# Altium schematic sheet Overview and Power.SchDoc
size A; SheetNumber: 1; SheetTotal: 9
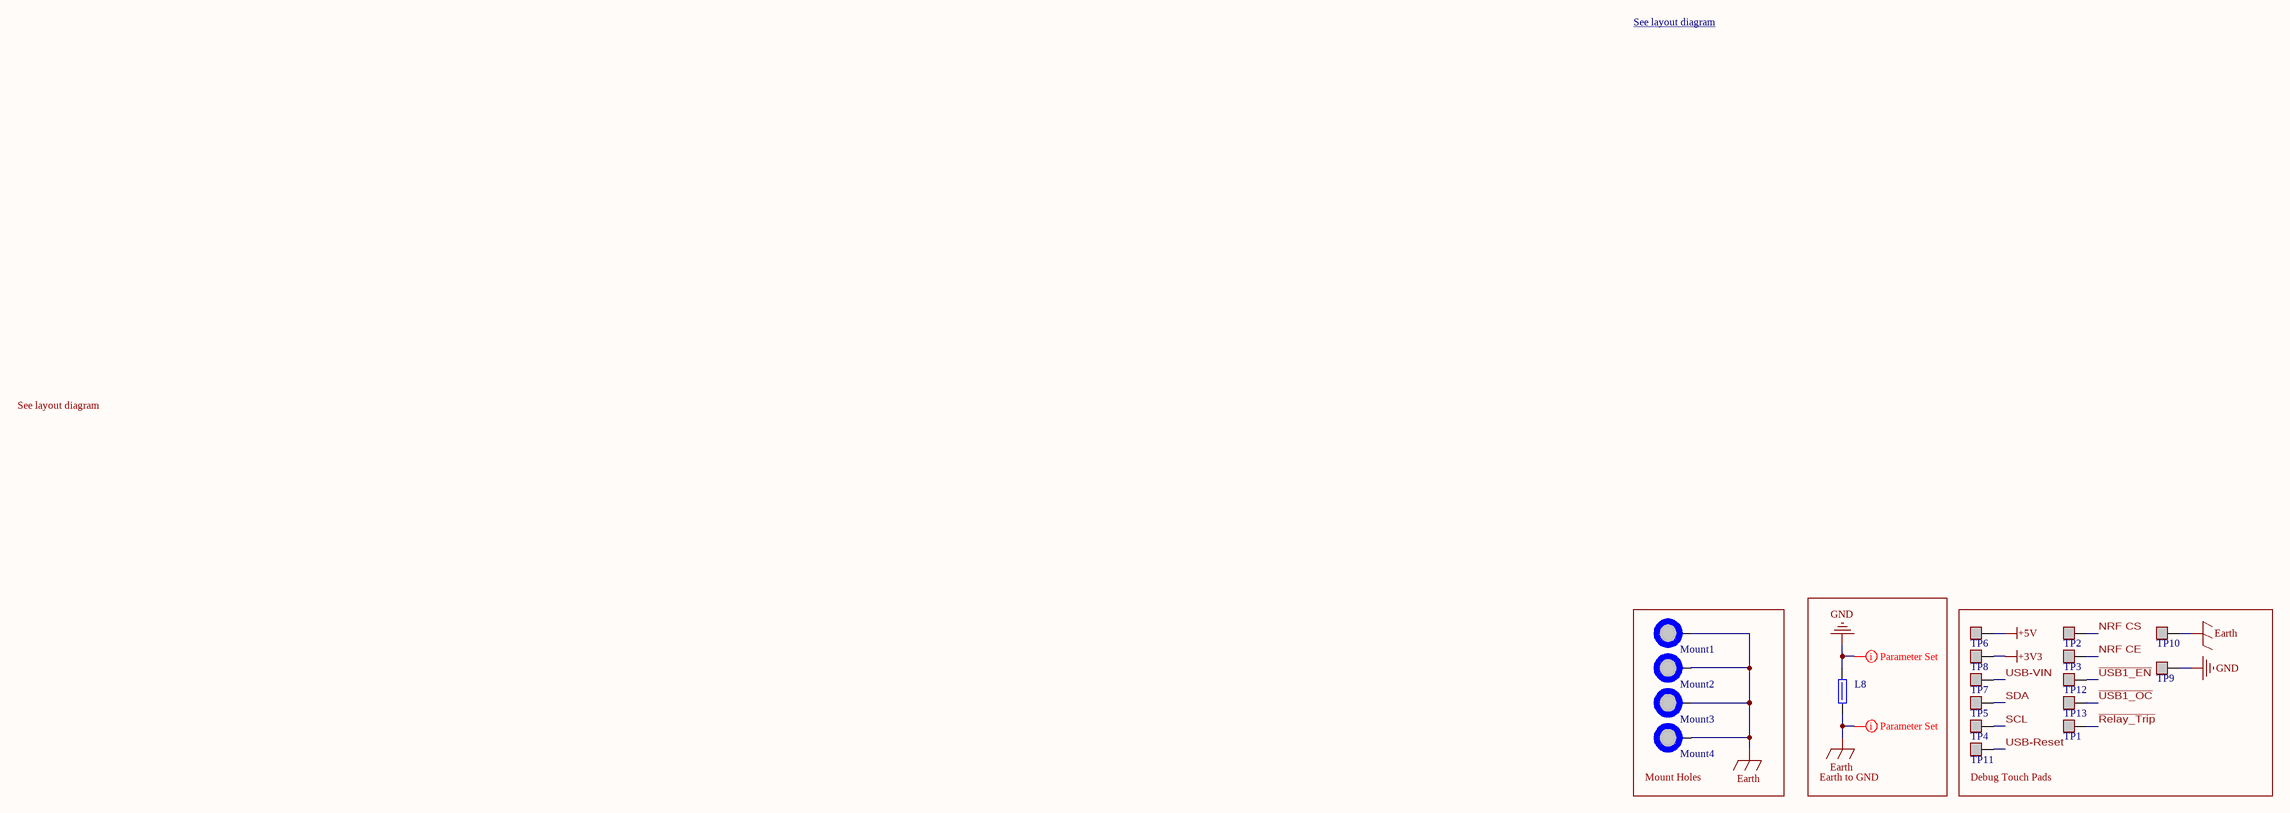
[diagram p0: Overview and Power.SchDoc]

## Parts
L8  742792040  [[Ferrite] SMD Bead 0805 (2)]  (value not drawn)
Mount1  M3 Mount Hole  [[Mount] M3 Mount Hole]  (value not drawn)  (no BOM)
Mount2  M3 Mount Hole  [[Mount] M3 Mount Hole]  (value not drawn)  (no BOM)
Mount3  M3 Mount Hole  [[Mount] M3 Mount Hole]  (value not drawn)  (no BOM)
Mount4  M3 Mount Hole  [[Mount] M3 Mount Hole]  (value not drawn)  (no BOM)
TP1  Probe Pad  [[Probe] Touch Pad]  (value not drawn)  (no BOM)
TP2  Probe Pad  [[Probe] Touch Pad]  (value not drawn)  (no BOM)
TP3  Probe Pad  [[Probe] Touch Pad]  (value not drawn)  (no BOM)
TP4  Probe Pad  [[Probe] Touch Pad]  (value not drawn)  (no BOM)
TP5  Probe Pad  [[Probe] Touch Pad]  (value not drawn)  (no BOM)
TP6  Probe Pad  [[Probe] Touch Pad]  (value not drawn)  (no BOM)
TP7  Probe Pad  [[Probe] Touch Pad]  (value not drawn)  (no BOM)
TP8  Probe Pad  [[Probe] Touch Pad]  (value not drawn)  (no BOM)
TP9  Probe Pad  [[Probe] Touch Pad]  (value not drawn)  (no BOM)
TP10  Probe Pad  [[Probe] Touch Pad]  (value not drawn)  (no BOM)
TP11  Probe Pad  [[Probe] Touch Pad]  (value not drawn)  (no BOM)
TP12  Probe Pad  [[Probe] Touch Pad]  (value not drawn)  (no BOM)
TP13  Probe Pad  [[Probe] Touch Pad]  (value not drawn)  (no BOM)

## Blocks framed on the sheet
Mount Holes: Mount1-Mount4
Earth to GND: L8
Debug Touch Pads: TP1-TP13

## Nets
+3V3: TP8.1
+5V: TP6.1
Earth: L8.1 Mount1.1 Mount2.1 Mount3.1 Mount4.1 TP10.1
GND: L8.2 TP9.1
~{Relay_Trip}: TP1.1
~{USB1_EN}: TP12.1
~{USB1_OC}: TP13.1
NRF CE: TP3.1
NRF CS: TP2.1
SCL: TP4.1
SDA: TP5.1
USB-Reset: TP11.1
USB-VIN: TP7.1

## Layout directives
net class Supply_Nets: Earth, GND

## Notes on the sheet
- See layout diagram <https://drive.google.com/file/d/1B1LZ2g49TOjqrB7c7O0v-CyvsEDjMjX-/view?usp=drive_link>
- See layout diagram

## Library data of the parts
L8 = [Ferrite] SMD Ferrite Bead (2): Supplier 1: DigiKey; Supplier Part Number 1: 732-1620-1-ND
Mount1-Mount4 = [Mount] M3 Mount Hole: Place at least 4.5mm from board edge. Plated.
TP1-TP13 = [Probe] Touch Pad